# Altium project SUBBOARD-gate_driver.PrjPcb
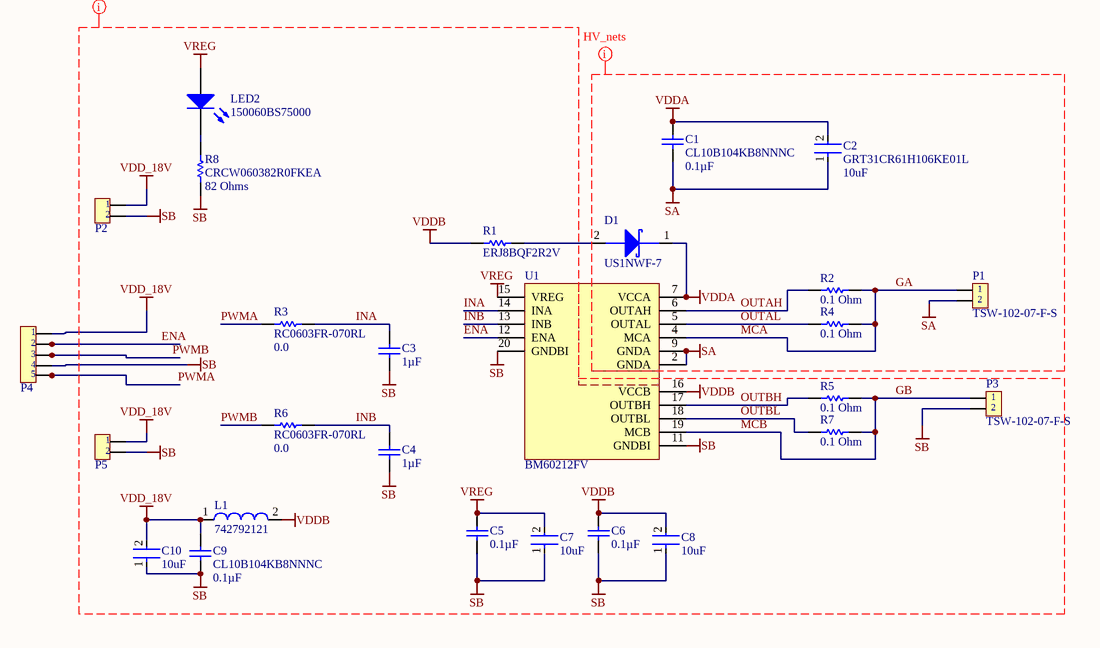
[diagram p0: SUBBOARD-gate_driver.SchDoc]
1 sheet, 27 parts. Net scope: global (net labels, ports and power ports of the same name join across sheets).
Board file: SUBBOARD-gate_driver.PcbDoc

## Sheet SUBBOARD-gate_driver.SchDoc
size A4

### Parts
C1  CL10B104KB8NNNC  Capacitance: 0.1µF  [SAMS-C0603-2_L]
C2  GRT31CR61H106KE01L  value 10uF  [FP-GRT31-0_2-MFG]
C3  Capacitance: 1µF  [CAPC1608X90X35LL10T25]  (hidden comment: LMK107B7105KA-T)
C4  Capacitance: 1µF  [CAPC1608X90X35LL10T25]  (hidden comment: LMK107B7105KA-T)
C5  Capacitance: 0.1µF  [SAMS-C0603-2_L]  (hidden comment: CL10B104KB8NNNC)
C6  Capacitance: 0.1µF  [SAMS-C0603-2_L]  (hidden comment: CL10B104KB8NNNC)
C7  value 10uF  [FP-GRT31-0_2-MFG]  (hidden comment: GRT31CR61H106KE01L)
C8  value 10uF  [FP-GRT31-0_2-MFG]  (hidden comment: GRT31CR61H106KE01L)
C9  CL10B104KB8NNNC  Capacitance: 0.1µF  [SAMS-C0603-2_L]
C10  value 10uF  [FP-GRT31-0_2-MFG]  (hidden comment: GRT31CR61H106KE01L)
D1  US1NWF-7  [SOD123F]
L1  742792121  [SMD-1206]
LED2  150060BS75000  [0603_A]
P1  TSW-102-07-F-S  [TSW-102-07-F-S]
P2  TSW-102-05-G-S  [TSW-102-05-G-S]  (value not drawn)
P3  TSW-102-07-F-S  [TSW-102-07-F-S]
P4  TSW-105-07-G-S  [TSW-105-07-G-S]  (value not drawn)
P5  TSW-102-05-G-S  [TSW-102-05-G-S]  (value not drawn)
R1  ERJ8BQF2R2V  [RESC3216X70X50NL05T20]
R2  value 0.1 Ohm  [RESC3216X70X50LL05T20]  (hidden comment: ERJ8BWFR100V)
R3  RC0603FR-070RL  Resistance (Ohms): 0.0  [RESC1608X55X25LL10T15]
R4  value 0.1 Ohm  [RESC3216X70X50LL05T20]  (hidden comment: ERJ8BWFR100V)
R5  value 0.1 Ohm  [RESC3216X70X50LL05T20]  (hidden comment: ERJ8BWFR100V)
R6  RC0603FR-070RL  Resistance (Ohms): 0.0  [RESC1608X55X25LL10T15]
R7  value 0.1 Ohm  [RESC3216X70X50LL05T20]  (hidden comment: ERJ8BWFR100V)
R8  CRCW060382R0FKEA  value 82 Ohms  [RESC1609X50X30LL10T20]
U1  BM60212FV  [SOP65P810X190-20N]

### Nets
SA: C1.2 C2.1 P1.2 U1.2(GNDA) U1.9(GNDA)
SB: C3.2 C4.2 C5.2 C6.2 C7.1 C8.1 C9.2 C10.1 P2.2 P3.2 P4.4 P5.2 R8.2 U1.11(GNDBI) U1.20(GNDBI)
VDD_18V: C9.1 C10.2 L1.1 P2.1 P4.1 P5.1
VDDA: C1.1 C2.2 D1.1(Cathode) U1.7(VCCA)
VDDB: C6.1 C8.2 L1.2 R1.1 U1.16(VCCB)
VREG: C5.1 C7.2 LED2.2(A) U1.15(VREG)
ENA: P4.2 U1.12(ENA)
GA: P1.1 R2.1 R4.1 U1.4(MCA)  [also labelled MCA]
GB: P3.1 R5.1 R7.1 U1.19(MCB)  [also labelled MCB]
INA: C3.1 R3.1 U1.14(INA)
INB: C4.1 R6.1 U1.13(INB)
OUTAH: R2.2 U1.6(OUTAH)
OUTAL: R4.2 U1.5(OUTAL)
OUTBH: R5.2 U1.17(OUTBH)
OUTBL: R7.2 U1.18(OUTBL)
PWMA: P4.5 R3.2
PWMB: P4.3 R6.2
NetD1_2: D1.2(Anode) R1.2
NetLED2_1: LED2.1(K) R8.1

### Layout directives
mark named HV_nets: GA, MCA, OUTAH, OUTAL, SA, VDDA
mark named LV_nets: ENA, GB, INA, INB, MCB, OUTBH, OUTBL, PWMA, PWMB, SB, VDD_18V, VDDB, VREG

### Library data of the parts
C1 C5 C6 C9 = CMP-2000-05332-1: Multi-layer Ceramic Capacitor, -55 to 125 degC, 2-Pin SMD (0603), RoHS, Tape and Reel; Manufacturer: Samsung Electro-Mechanics; Rated Voltage: 50V; Dielectric: X7R; Tolerance (%): ±10%; Case Size/Dimension: 0603; Datasheet URL: https://datasheet.ciiva.com/29198/456651-da-01-en-vs-kondensator-0605-29198839.pdf; Manufacturer URL: http://www.samsungsem.com/global/index.jsp; Datasheet Version: Nov-10
C2 C7 C8 C10 = CMP-06035-000076-1: CAP CER 10UF 50V X5R 1206; Manufacturer: Murata; Temperature Coefficient: 15%; Tolerance: 10%; Material: Ceramic; Automotive Grade: Grade 3; Height: 1.8mm; Ipc Land Pattern Name: CAPC320160X160; Octopart: https://octopart.com/grt31cr61h106ke01l-murata-62921736; Digikey Description: CAP CER 10UF 50V X5R 1206; Voltage Rating: 50V; Device Class L3: Ceramic Capacitors; ComponentLink2URL: https://search.murata.co.jp/Ceramy/image/img/A01X/G101/ENG/GRT31CR61H106KE01-01.pdf; Device Class L1: Passive Components; Temperature Range High: +85°C; Lead Free: Yes; Capacitance: 10uF; Manufacturer Part Number: GRT31CR61H106KE01L; Temperature Range Low: -55°C; Temperature Characteristic: X5R; Category: Cap; Automotive: Yes; ComponentLink2Description: Datasheet; Device Class L2: Capacitors; Package: GRT31-0.2; RoHS: TRUE; Temperature: -55°C to +85°C
C3 C4 = CMP-2000-05445-1: High Value Multilayer Ceramic Capacitor, 1 uF, +/- 10%, 10 V, -55 to 125 degC, 0603 (1608 Metric), RoHS, Tape and Reel; Manufacturer: Taiyo Yuden; PCN Part Number: X5R,X7RDielectrics23/Jan/2008; Voltage - Rated: 10V; Temperature Coefficient: X7R; Other Names: 587-1242-1; Kits: 587-1797-KIT-ND-KITCAPCERHICAP0603&0805S; Online Catalog: MSeries; Catalog Drawings: xMKSeries_0603_0.8; Package / Case: 0603(1608Metric); Features: -; Package Description: 2-Pin Surface Mount Device, Body 1.6 x 0.8 mm; Lead Style: -; Manufacturer URL: http://www.t-yuden.com/; Package Reference: 603; Datasheet URL: https://datasheet.ciiva.com/30248/464lmk107b7105ka-t-30248417.pdf; Tolerance: ±10%; Size / Dimension: 0.063"Lx0.031"W(1.60mmx0.80mm); Family: CeramicCapacitors; Standard Package: 1; Height - Seated (Max): -; Series: M; Mounting Type: SurfaceMount,MLCC; Thickness (Max): 0.035"(0.90mm); Packaging: CutTape(CT); Operating Temperature: -55degC~125degC; Applications: GeneralPurpose; Lead Spacing: -; Datasheet Version: Apr-14; Ratings: -; Category: Capacitors
D1 = US1NWF-7: DIODE GEN PURP 1.2KV 1A SOD123F; Manufacturer: Diodes; Reverse Recovery Time: 80ns; Manufacturer Part Number: US1NWF-7; RoHS: No; Category: Rectifier Diodes; Stock 1: 6339; Pricing 1: 1=0,50000, 10=0,40300, 25=0,36840, 100=0,23130, 250=0,22868, 500=0,21412, 1000=0,14561 (USD); Mount: Surface Mount; Packaging: Tape and Reel; Max Reverse Voltage (DC): 1.2kV; Average Rectified Current: 1A; ComponentLink1URL: https://www.diodes.com/assets/Datasheets/US1NWF.pdf?src-supplier=Digi-Key; ComponentLink1Description: https://www.diodes.com/assets/Datasheets/US1NWF.pdf?src-supplier=Digi-Key; Supplier 1: Digi-Key; Supplier 2: Mouser; Supplier Part Number 1: US1NWF-7DICT-ND; Supplier Part Number 2: 621-US1NWF-7
L1 = CMP-0220-00006-1: SMD EMI Suppression Ferrite Bead WE-CBF, Z = 300 Ohm; Impedance: 300 Ohm; ComponentLink1Description: Manufacturer Link; ComponentLink1URL: http://www.we-online.com; ComponentLink2Description: Datasheet; PackageVersion: 2007; PackageDescription: Chip Inductor, 2-Leads, Body 3.2 x 1.6 mm; ComponentLink2URL: http://www.we-online.de/katalog/media/pdf/742792121.pdf; DatasheetVersion: Dec-2005; PackageReference: SMD-1206
LED2 = CMP-1426-00003-1: SMD mono-color Chip LED, WL-SMCW, Blue; Manufacturer: Wuerth Elektronik; Color: Blue; ComponentLink2Description: Datasheet; ComponentLink2URL: http://katalog.we-online.com/led/datasheet/150060BS75000.pdf; ComponentLink1URL: http://www.we-online.com; PackageReference: 0603_A; PartNumber: 150060BS75000; ComponentLink1Description: Manufacturer URL
P1 P3 = TSW-102-07-F-S: Conn Unshrouded Header HDR 2 POS 2.54mm Solder ST Thru-Hole; Manufacturer: Samtec; Number of Contacts: 2; Gender: Male; Max Voltage Rating (AC): 550V; Connector Type: Male Pin; Max Current Rating: 7.6A; Manufacturer Part Number: TSW-102-07-F-S; RoHS: Yes; Category: Connectors; Stock 1: 10739; Pricing 1: 1=0,20000, 10=0,18800, 100=0,13000, 500=0,11000, 1000=0,09000, 5000=0,08000, 10000=0,07250 (USD); Mount: Through Hole; Contact Plating: Gold; Contact Material: Bronze; Housing Color: Black; Housing Material: Polyester; Color: Black; Min Operating Temperature: -55°C; Max Operating Temperature: 125°C; Number of Rows: 1; Termination: Solder; Packaging: Rail/Tube; Orientation: Straight; Number of Positions: 2; Package Quantity: 1; Length: 5.08mm; Pitch: 2.54mm; Contact Mating Length: 0.23inch; Depth: 2.54mm; Radiation Hardening: No; REACH SVHC: No SVHC; ComponentLink1URL: https://datasheet.ciiva.com/739/tsw-xxx-xx-xxx-x-xx-xxx-mkt-739881.pdf?src-supplier=Digi-Key; ComponentLink1Description: https://datasheet.ciiva.com/739/tsw-xxx-xx-xxx-x-xx-xxx-mkt-739881.pdf?src-supplier=Digi-Key; ComponentLink2URL: https://datasheet.ciiva.com/10281/htsw-th-10281262.pdf?src-supplier=Avnet; ComponentLink2Description: https://datasheet.ciiva.com/10281/htsw-th-10281262.pdf?src-supplier=Avnet; ComponentLink3URL: https://datasheet.ciiva.com/16734/htsw-th-16734219.pdf?src-supplier=Avnet+Europe; ComponentLink3Description: https://datasheet.ciiva.com/16734/htsw-th-16734219.pdf?src-supplier=Avnet+Europe; Supplier 1: Digi-Key; Supplier 2: Arrow; Supplier 3: Mouser; Supplier 4: Farnell; Supplier 5: Newark; Supplier Part Number 5: 79P3146; Supplier Part Number 4: 2779661; Supplier Part Number 3: 200-TSW10207FS; Supplier Part Number 2: TSW-102-07-F-S; Supplier Part Number 1: SAM10844-ND
P2 P5 = TSW-102-05-G-S: Conn Unshrouded Header HDR 2 POS 2.54mm Solder ST Thru-Hole Automotive Bulk; Manufacturer: Samtec; Number of Contacts: 2; Gender: Male; Max Current Rating: 7.6A; Max Voltage Rating (AC): 550V; Connector Type: Male Pin; Supplier 1: Digi-Key; Manufacturer Part Number: TSW-102-05-G-S; RoHS: Yes; Category: Connectors; Stock 1: 277; Pricing 1: 1=0.28000, 10=0.26500, 25=0.22760, 50=0.19340, 100=0.18580, 250=0.16684, 500=0.15926 (USD); Mount: Through Hole; Contact Plating: Gold; Contact Material: Bronze; Housing Material: Polyester; Housing Color: Black; Color: Black; Min Operating Temperature: -55°C; Max Operating Temperature: 125°C; Number of Rows: 1; Termination: Solder; Packaging: Bulk; Orientation: Straight; Package Quantity: 1; Number of Positions: 2; Length: 5.08mm; Pitch: 2.54mm; Depth: 2.54mm; Contact Mating Length: 0.105inch; Width: 2.54mm; Radiation Hardening: No; Lead Free: Lead Free; REACH SVHC: No SVHC; ComponentLink1URL: http://components.arrow.com/part/dataview/0323_03819665?src-supplier=Arrow+Europe; ComponentLink1Description: http://components.arrow.com/part/dataview/0323_03819665?src-supplier=Arrow+Europe; ComponentLink2URL: http://components.arrow.com/part/dataview/2679278S8183086N1004?src-supplier=Arrow; ComponentLink2Description: http://components.arrow.com/part/dataview/2679278S8183086N1004?src-supplier=Arrow; ComponentLink3URL: http://www.farnell.com/datasheets/2571078.pdf?src-supplier=Farnell; ComponentLink3Description: http://www.farnell.com/datasheets/2571078.pdf?src-supplier=Farnell; ComponentLink4URL: http://www.farnell.com/datasheets/1992055.pdf?src-supplier=Farnell; ComponentLink4Description: http://www.farnell.com/datasheets/1992055.pdf?src-supplier=Farnell; ComponentLink5URL: http://www.samtec.com/ftppub/pdf/htsw_th.pdf?src-supplier=Avnet; ComponentLink5Description: http://www.samtec.com/ftppub/pdf/htsw_th.pdf?src-supplier=Avnet; ComponentLink6URL: http://suddendocs.samtec.com/prints/tsw-xxx-xx-x-x-xx-xxx-footprint.pdf?src-supplier=Digi-Key; ComponentLink6Description: http://suddendocs.samtec.com/prints/tsw-xxx-xx-x-x-xx-xxx-footprint.pdf?src-supplier=Digi-Key; Supplier Part Number 1: SAM1013-02-ND
P4 = TSW-105-07-G-S: SAMTEC - TSW-105-07-G-S - Board-To-Board Connector, 2.54 mm, 5 Contacts, Header, TSW Series, Through Hole, 1 Rows; Number of Contacts: 5; Gender: Male; Max Current Rating: 7.6A; Max Voltage Rating (AC): 550V; Connector Type: Male Pin; Pitch: 2.54mm; Supplier 1: Digi-Key; Manufacturer: Samtec; Manufacturer Part Number: TSW-105-07-G-S; RoHS: Yes; Category: Headers and Wire Housings; Stock 1: 1466; Pricing 1: 1=0.55000, 10=0.51100, 25=0.46000, 50=0.40900, 100=0.39190, 250=0.35784, 500=0.34080 (USD); Mount: Through Hole; Contact Plating: Gold; Contact Material: Bronze; Housing Color: Black; Housing Material: Polyester; Color: Black; Min Operating Temperature: -55°C; Max Operating Temperature: 125°C; Termination: Solder; Number of Rows: 1; Packaging: Bulk; Orientation: Straight; Package Quantity: 1; Number of Positions: 5; Length: 12.7mm; Depth: 2.54mm; Contact Mating Length: 0.23inch; Width: 2.54mm; Radiation Hardening: No; Lead Free: Lead Free; REACH SVHC: No SVHC; ComponentLink1URL: https://datasheet.ciiva.com/6888/tsw-xxx-xx-xxx-x-xx-xxx-mkt-6888902.pdf?src-supplier=Digi-Key; ComponentLink1Description: https://datasheet.ciiva.com/6888/tsw-xxx-xx-xxx-x-xx-xxx-mkt-6888902.pdf?src-supplier=Digi-Key; ComponentLink2URL: https://datasheet.ciiva.com/16724/htsw-th-16724458.pdf?src-supplier=Avnet+Europe; ComponentLink2Description: https://datasheet.ciiva.com/16724/htsw-th-16724458.pdf?src-supplier=Avnet+Europe; ComponentLink3URL: https://datasheet.ciiva.com/48561/htsw-th-48561324.pdf?src-supplier=Avnet; ComponentLink3Description: https://datasheet.ciiva.com/48561/htsw-th-48561324.pdf?src-supplier=Avnet; Supplier Part Number 1: SAM1029-05-ND
R1 = CMP-2003-00737-1: Manufacturer: Panasonic; Part Number: ERJ8BQF2R2V
R2 R4 R5 R7 = CMP-2003-00785-1: Manufacturer: Panasonic; Part Number: ERJ8BWFR100V; Package: 1206
R3 R6 = CMP-2000-06925-1: Chip Resistor, 0 Ohm, +/- 1%, 100 mW, -55 to 155 degC, 0603 (1608 Metric), RoHS, Tape and Reel; Manufacturer: Yageo; Power (Watts): 0.1W,1/10W; HTML Datasheet: RCSeries,LSuffixDatasheet.html; PCN Other: RC/AC0603/0805/120622/Jan/2013; Online Catalog: RC0603Series; EDA / CAD Models: DownloadfromAcceleratedDesigns; Other Names: 311-0.0HRTRQ3106287ARC0603FR-070RL-ND; Catalog Drawings: ThickFilmResistorSide; Tolerance: Jumper; Manufacturer URL: http://www.yageo.com/; Family: ChipResistor-SurfaceMount; Product Training Modules: ChipResistor; Number of Terminations: 2; Package / Case: 0603(1608Metric); Datasheet Version: Rev. 7, 05/2017; Operating Temperature: -55°C~155°C; Height: 0.022"(0.55mm); Packaging: Tape&Reel(TR); Size / Dimension: 0.063"Lx0.031"W(1.60mmx0.80mm); Package Description: 2-Pin Surface Mount Device, Body 1.6 x 0.8 mm; Package Reference: 0603; Mounting Technology: SurfaceMount; Features: MoistureResistant; Temperature Coefficient: -; Supplier Device Package: 0603; Datasheet URL: http://www.yageo.com/documents/recent/PYu-RC_Group_51_RoHS_L_7.pdf; Standard Package: 5,000; Series: RC; Category: Resistors; Composition: ThickFilm
R8 = CMP-2000-03606-1: Manufacturer: Vishay Dale; Part Number: CRCW060382R0FKEA
U1 = BM60212FV-CE2: MOSFET and Power Driver 2-OUT Hi/Lo Side Non-Inv 20-Pin SSOP-BW Emboss T/R; Manufacturer: Rohm; Manufacturer Part Number: BM60212FV-CE2; Stock 1: 1999; Pricing 1: 1=4,24000, 10=3,80800, 25=3,60000, 100=2,96000, 250=2,65600, 500=2,56000, 1000=2,24000 (USD); Supplier 1: DigiKey; Supplier 2: Digi-Key; Supplier 3: Digi-Key; Supplier 4: Mouser; Supplier 5: Farnell; Supplier 6: Newark; Supplier Part Number 6: 01AH6823; Supplier Part Number 5: 3011496; Supplier Part Number 4: 755-BM60212FV-CE2; Supplier Part Number 3: BM60212FV-CE2DKR-ND; Supplier Part Number 2: BM60212FV-CE2CT-ND; Supplier Part Number 1: BM60212FV-CE2CT-ND